# EAGLE design sequencer (EAGLE 9.6.2)
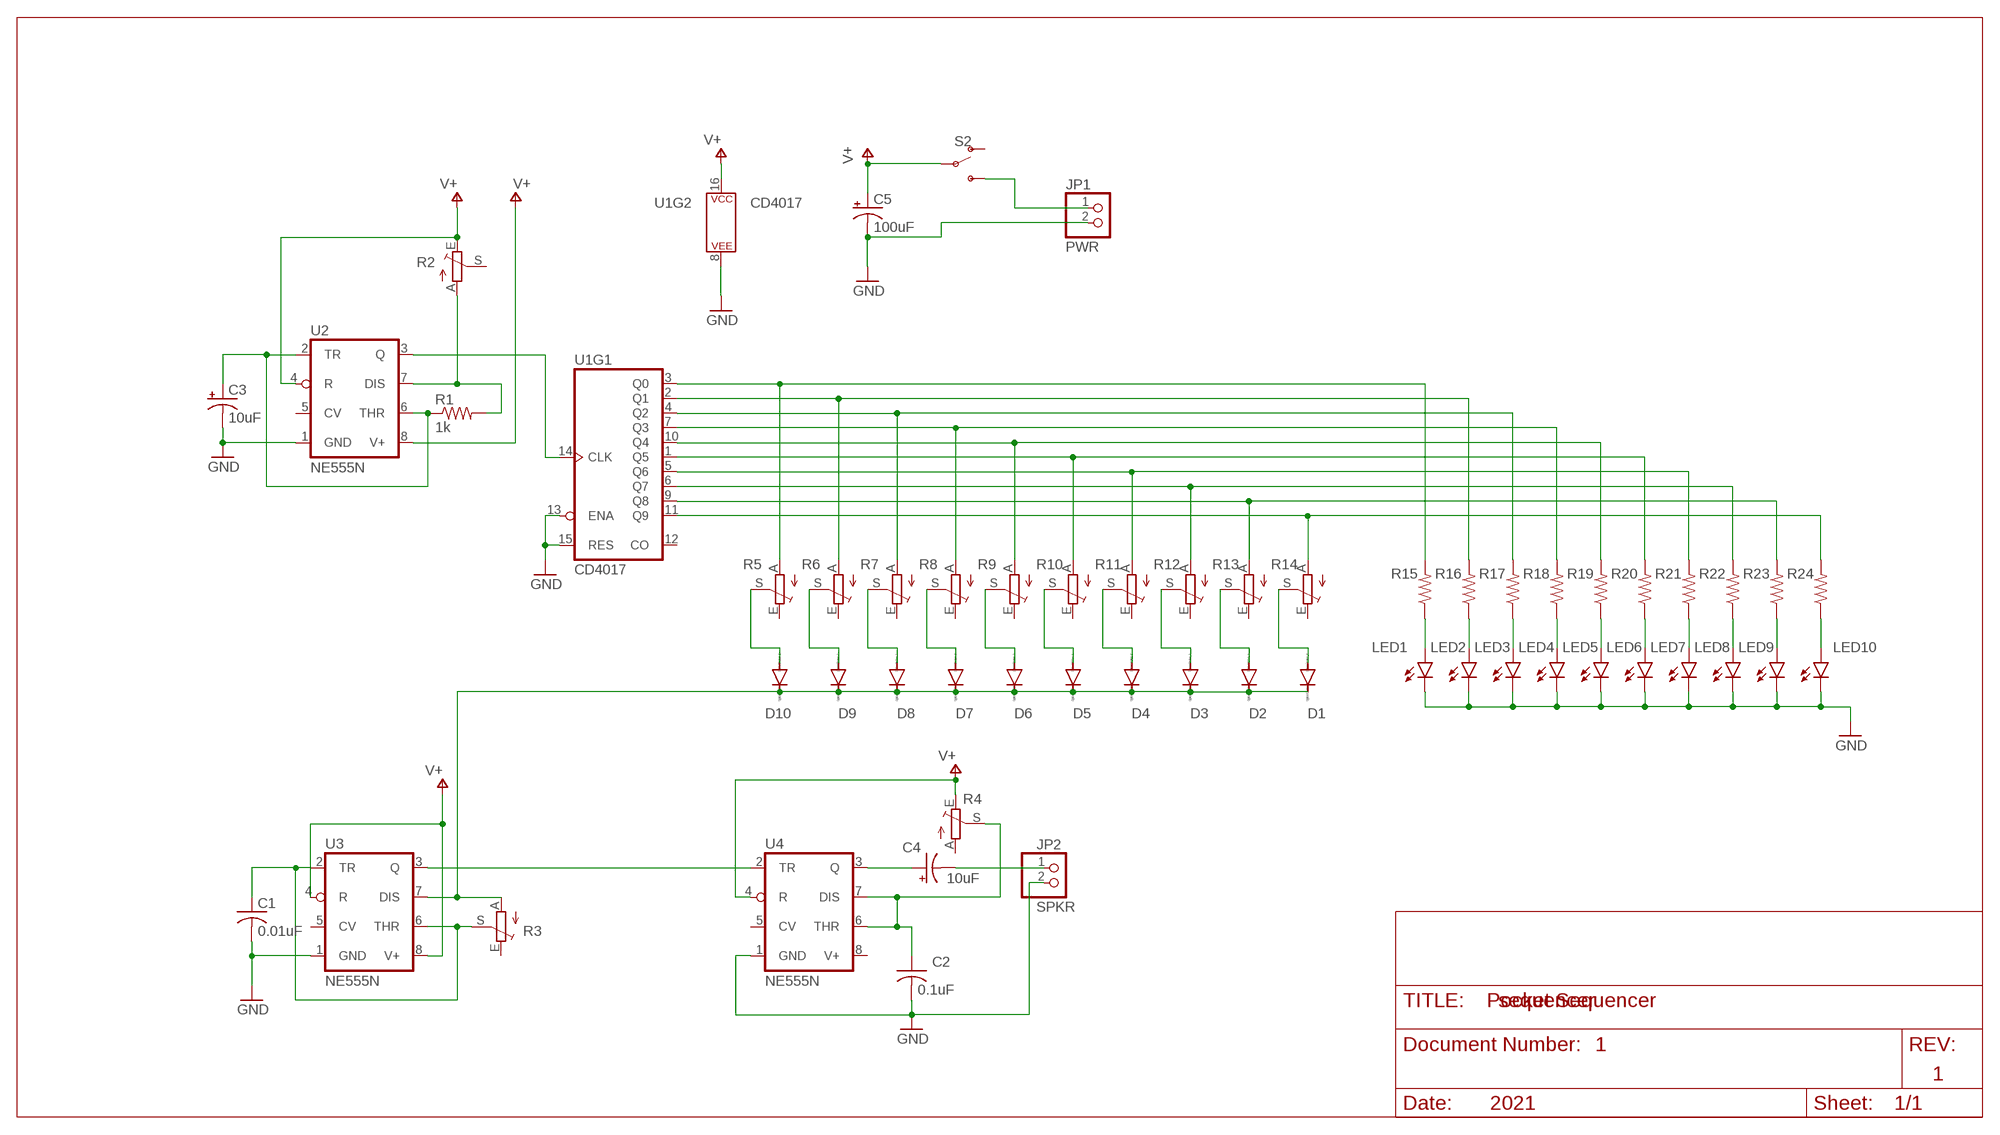
[diagram p0: schematic, sheet 1]

## Parts
C1  0.01uF  C-US025-025X050  [C025-025X050]
C2  0.1uF  C-US025-025X050  [C025-025X050]
C3  10uF  CPOL-USE2.5-6  [E2,5-6]
C4  10uF  CPOL-USE2.5-6  [E2,5-6]
C5  100uF  CPOL-USE2.5-7  [E2,5-7]
D1  1N4148DO35-7  [DO35-7]
D2  1N4148DO35-7  [DO35-7]
D3  1N4148DO35-7  [DO35-7]
D4  1N4148DO35-7  [DO35-7]
D5  1N4148DO35-7  [DO35-7]
D6  1N4148DO35-7  [DO35-7]
D7  1N4148DO35-7  [DO35-7]
D8  1N4148DO35-7  [DO35-7]
D9  1N4148DO35-7  [DO35-7]
D10  1N4148DO35-7  [DO35-7]
JP1  PWR  PINHD-1X2  [1X02]
JP2  SPKR  PINHD-1X2  [1X02]
LED1  LED3MM  [LED3MM]
LED2  LED3MM  [LED3MM]
LED3  LED3MM  [LED3MM]
LED4  LED3MM  [LED3MM]
LED5  LED3MM  [LED3MM]
LED6  LED3MM  [LED3MM]
LED7  LED3MM  [LED3MM]
LED8  LED3MM  [LED3MM]
LED9  LED3MM  [LED3MM]
LED10  LED3MM  [LED3MM]
R1  1k  R-US_0207/7  [0207/7]
R2  TRIM_EU-CT6  [CT6]
R3  TRIM_EU-CT6  [CT6]
R4  TRIM_EU-CT6  [CT6]
R5  TRIM_EU-CT6  [CT6]
R6  TRIM_EU-CT6  [CT6]
R7  TRIM_EU-CT6  [CT6]
R8  TRIM_EU-CT6  [CT6]
R9  TRIM_EU-CT6  [CT6]
R10  TRIM_EU-CT6  [CT6]
R11  TRIM_EU-CT6  [CT6]
R12  TRIM_EU-CT6  [CT6]
R13  TRIM_EU-CT6  [CT6]
R14  TRIM_EU-CT6  [CT6]
R15  R-US_0207/7  [0207/7]
R16  R-US_0207/7  [0207/7]
R17  R-US_0207/7  [0207/7]
R18  R-US_0207/7  [0207/7]
R19  R-US_0207/7  [0207/7]
R20  R-US_0207/7  [0207/7]
R21  R-US_0207/7  [0207/7]
R22  R-US_0207/7  [0207/7]
R23  R-US_0207/7  [0207/7]
R24  R-US_0207/7  [0207/7]
S2  SWITCH-SPDT-PTH-8.6X4.3MM  [SWITCH_SPDT_8.6X4.3MM]
U1  CD4017  [DIP16]
U2  NE555N  [DIL08]
U3  NE555N  [DIL08]
U4  NE555N  [DIL08]

## Nets
GND [power]: C1.2 C2.2 C3.- C5.- JP1.2 JP2.2 LED1.K(C) LED2.K(C) LED3.K(C) LED4.K(C) LED5.K(C) LED6.K(C) LED7.K(C) LED8.K(C) LED9.K(C) LED10.K(C) U1.8(P$V-) U1.13(ENA) U1.15(RES) U2.1(GND) U3.1(GND) U4.1(GND)
N$1: R1.2 R2.A U2.7(DIS)
N$2: C3.+ R1.1 U2.2(TR) U2.6(THR)
N$3: U1.14(CLK) U2.3(Q)
N$4: R5.A R15.2 U1.3(Q0)
N$5: R6.A R16.2 U1.2(Q1)
N$6: R7.A R17.2 U1.4(Q2)
N$7: R8.A R18.2 U1.7(Q3)
N$8: R9.A R19.2 U1.10(Q4)
N$9: R10.A R20.2 U1.1(Q5)
N$10: R11.A R21.2 U1.5(Q6)
N$11: R12.A R22.2 U1.6(Q7)
N$12: R13.A R23.2 U1.9(Q8)
N$13: R14.A R24.2 U1.11(Q9)
N$14: D10.A R5.S
N$15: D9.A R6.S
N$16: D8.A R7.S
N$17: D7.A R8.S
N$18: D6.A R9.S
N$19: D5.A R10.S
N$20: D4.A R11.S
N$21: D3.A R12.S
N$22: D2.A R13.S
N$23: D1.A R14.S
N$24: LED1.A R15.1
N$25: LED2.A R16.1
N$26: LED3.A R17.1
N$27: LED4.A R18.1
N$28: LED5.A R19.1
N$29: LED6.A R20.1
N$30: LED7.A R21.1
N$31: LED8.A R22.1
N$32: LED9.A R23.1
N$33: LED10.A R24.1
N$34: C2.1 R4.S U4.6(THR) U4.7(DIS)
N$35: JP1.1 S2.3(S)
N$36: C1.1 R3.S U3.2(TR) U3.6(THR)
N$37: U3.3(Q) U4.2(TR)
N$38: D1.C D2.C D3.C D4.C D5.C D6.C D7.C D8.C D9.C D10.C R3.A U3.7(DIS)
N$39: C4.+ U4.3(Q)
N$40: C4.- JP2.1
V+ [power]: C5.+ R2.E R4.E S2.2(P) U1.16(P$V+) U2.4(R) U2.8(V+) U3.4(R) U3.8(V+) U4.4(R)
Unconnected: R2.S R3.E R4.A R5.E R6.E R7.E R8.E R9.E R10.E R11.E R12.E R13.E R14.E S2.1(O) U1.12(CO) U2.5(CV) U3.5(CV) U4.5(CV)

## Notes on the sheet
- Pocket Sequencer
- 1
- 1
- 2021

## Power pins joined to a net without a drawn wire
V+: U4.8(V+)

## Library data of the parts
C1 C2 = rcl:C-US: CAPACITOR, American symbol; SPICEPREFIX: C
C3-C5 = rcl:CPOL-US: POLARIZED CAPACITOR, American symbol; SPICEPREFIX: C
D1-D10 = diode:1N4148: DIODE high speed (Philips)
JP1 JP2 = pinhead:PINHD-1X2: PIN HEADER
LED1-LED10 = led:LED: LED OSRAM: - CHIPLED LG R971, LG N971, LY N971, LG Q971, LY Q971, LO R971, LY R971 LH N974, LH R974 LS Q976, LO Q976, LY Q976 LO Q996 - Hyper CHIPLED LW Q18S LB Q993, LB Q99A, LB R99A - SideLED LS A670, LO A670, LY A670, LG A670, LP A670 LB A673, LV A673, LT A673, LW A673 LH A674 LY A675 LS A676, LA A676, LO A676, LY A676, LW A676 LS A679, LY A679, LG A679 - Hyper Micro SIDELED® LS Y876, LA Y876, LO Y876, LY Y876 LT Y87S - SmartLED LW L88C, LW L88S LB L89C, LB L89S, LG L890 LS L89K, LO L89K, LY L89K LS L896, LA L896, LO L896, LY L896 - TOPLED LS T670, LO T670, LY T670, LG T670, LP T670 LSG T670, LSP T670, LSY T670, LOP T670, LYG T670 LG T671, LOG T671, LSG T671 LB T673, LV T673, LT T673, LW T673 LH T674 LS T676, LA T676, LO T676, LY T676, LB T676, LH T676, LSB T676, LW T676 LB T67C, LV T67C, LT T67C, LS T67K, LO T67K, LY T67K, LW E67C LS E67B, LA E67B, LO E67B, LY E67B, LB E67C, LV E67C, LT E67C LW T67C LS T679, LY T679, LG T679 LS T770, LO T770, LY T770, LG T770, LP T770 LB T773, LV T773, LT T773, LW T773 LH T774 LS E675, LA E675, LY E675, LS T675 LS T776, LA T776, LO T776, LY T776, LB T776 LHGB T686 LT T68C, LB T68C - Hyper Mini TOPLED® LB M676 - Mini TOPLED Santana® LG M470 LS M47K, LO M47K, LY M47K Source: http://www.osram.convergy.de LUXEON: - LUMILED® LXK2-PW12-R00, LXK2-PW12-S00, LXK2-PW14-U00, LXK2-PW14-V00 LXK2-PM12-R00, LXK2-PM12-S00, LXK2-PM14-U00 LXK2-PE12-Q00, LXK2-PE12-R00, LXK2-PE12-S00, LXK2-PE14-T00, LXK2-PE14-U00 LXK2-PB12-K00, LXK2-PB12-L00, LXK2-PB12-M00, LXK2-PB14-N00, LXK2-PB14-P00, LXK2-PB14-Q00 LXK2-PR12-L00, LXK2-PR12-M00, LXK2-PR14-Q00, LXK2-PR14-R00 LXK2-PD12-Q00, LXK2-PD12-R00, LXK2-PD12-S00 LXK2-PH12-R00, LXK2-PH12-S00 LXK2-PL12-P00, LXK2-PL12-Q00, LXK2-PL12-R00 Source: www.luxeon.com KINGBRIGHT: KA-3528ASYC Source: www.kingbright.com
R1 R15-R24 = rcl:R-US_: RESISTOR, American symbol; SPICEPREFIX: R
R2-R14 = pot:TRIM_EU-: POTENTIOMETER
S2 = SparkFun-Switches:SWITCH-SPDT: Single Pole, Double Throw (SPDT) Switch Single-pole, double-throw (SPDT) switch. Variant Overview SMD-AYZ0202 Surface Mount DPDT Switch <https://www.sparkfun.com/products/597> (COM-00597) Used on e.g. LilyPad Arduino USB - ATmega32U4 Board <https://www.sparkfun.com/products/12049> PTH-11.6X4.0MM SPDT Mini Power Switch <https://www.sparkfun.com/products/102> (COM-00102) Used on e.g. SparkFun Simon Says - Through-Hole Soldering Kit <https://www.sparkfun.com/products/10547> (KIT-10547) PTH-11.6X4.0MM-KIT KIT version of SPDT Mini Power Switch - Simplifies soldering by removing tStop of switch pins - only one side can be soldered. PTH-11.6X4.0MM-LOCK LOCK version of SPDT Mini Power Switch - Offset pins hold switch in place for easier soldering. SMD-RIGHT-ANGLE Surface Mount Right Angle Switch <https://www.sparkfun.com/products/10860> (COM-10860) Used on e.g. SparkFun ESP8266 Thing <https://www.sparkfun.com/products/13231>; PROD_ID: SWCH-14746
U1 = SparkFun-IC-Logic:CD4017: 10-Out Decade Counter Datasheet <https://cdn.sparkfun.com/datasheets/Kits/cd4022b.pdf> SparkFun Products SparkFun SparkPunk Sequencer Kit <https://www.sparkfun.com/products/12707> (KIT-12707); PROD_ID: IC-11929
U2-U4 = linear:*555: TIMER

## Net classes
0 default: width 0.762 mm
1 power: width 1.27 mm

## Board
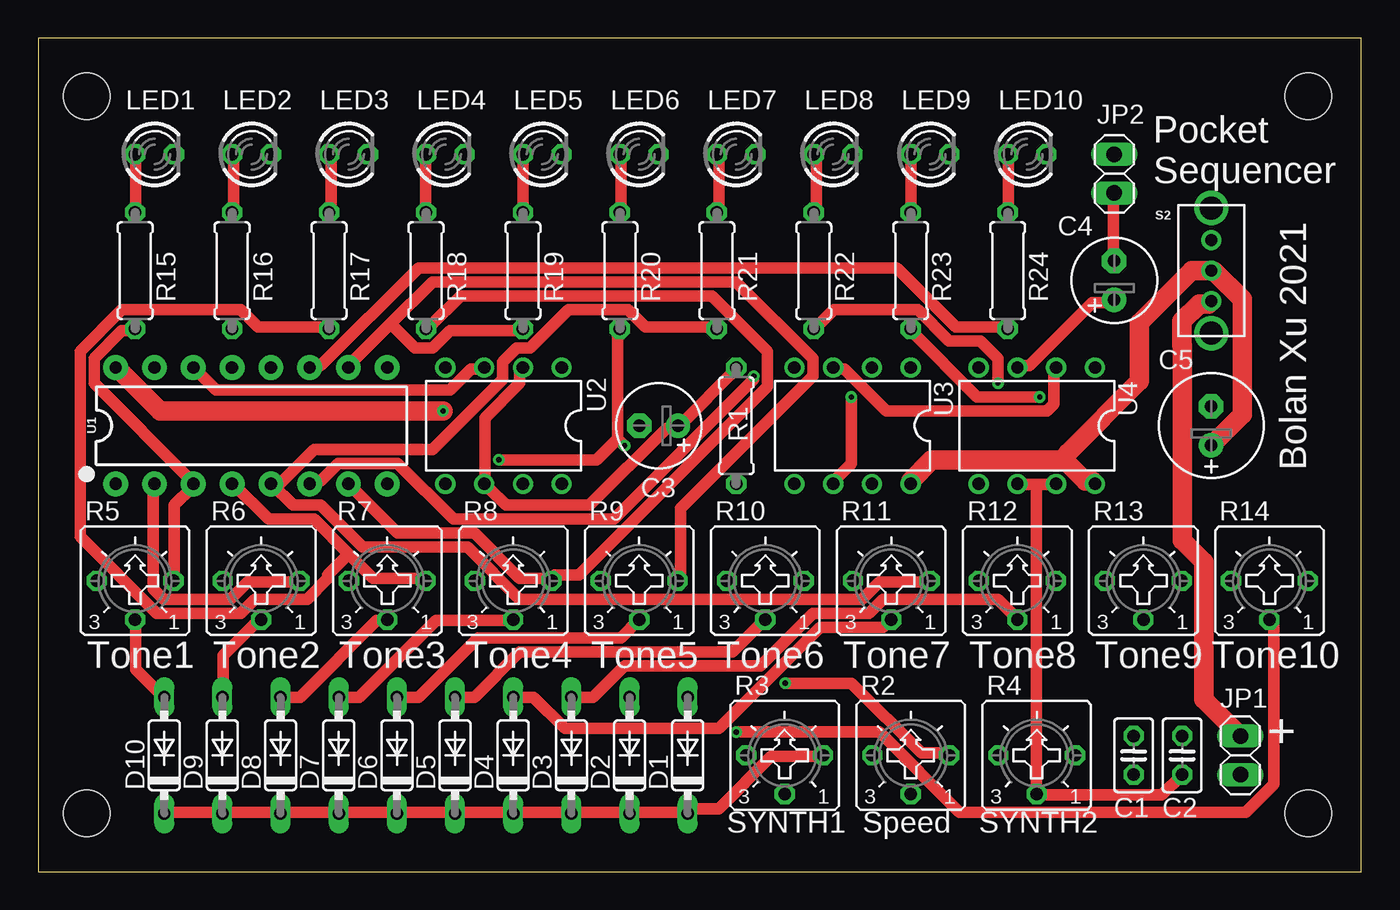
[diagram p1: board, top side]
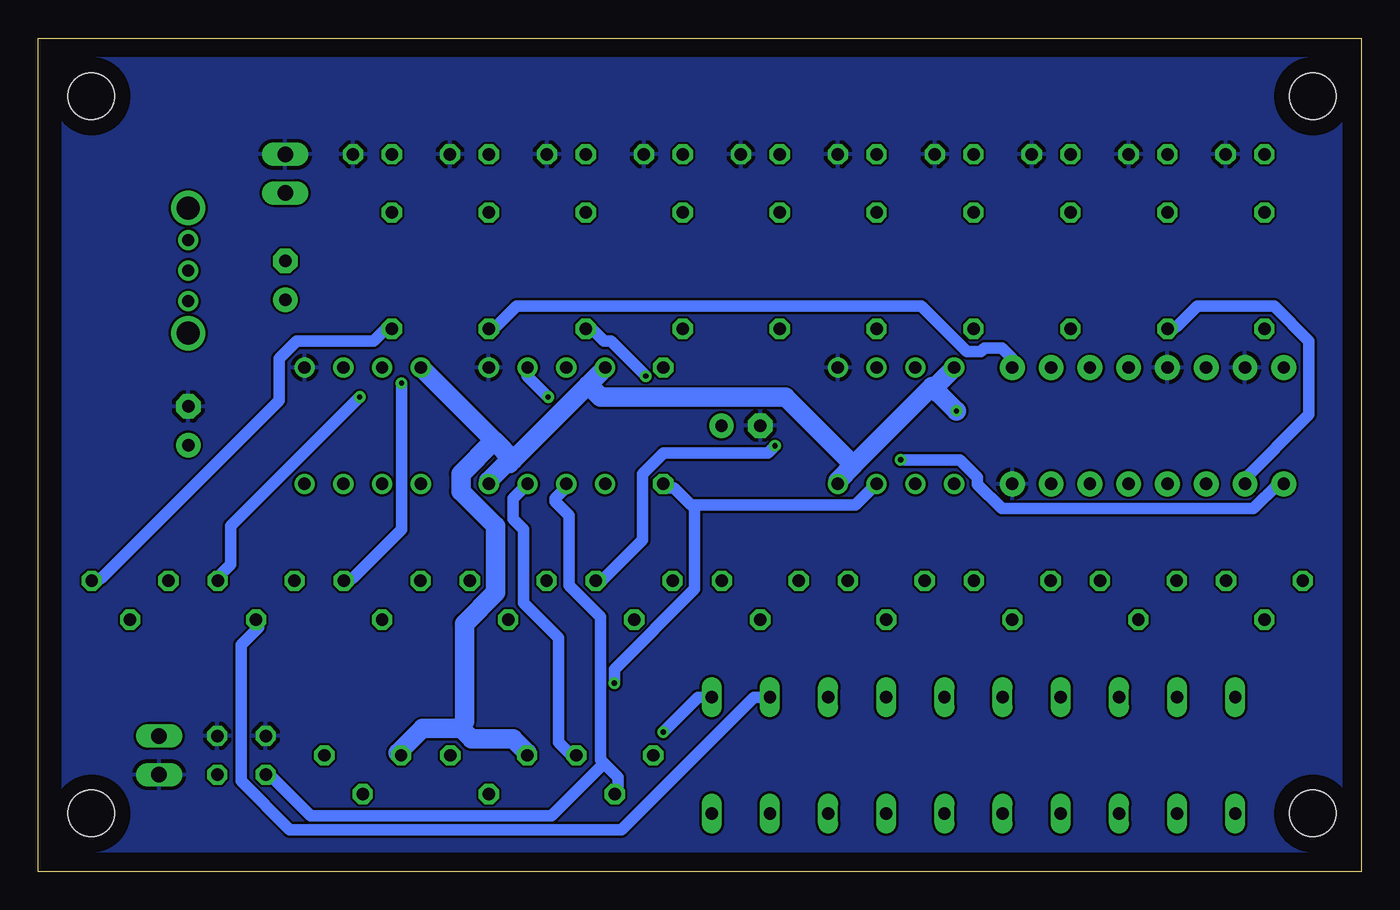
[diagram p2: board, bottom side, seen from below]

Size 86.67 x 54.6 mm. Coordinates in mm from the lower left corner, seen from the top.
Outline: 0,0 86.67,0 86.67,54.6 0,54.6 0,0
Copper layers (1*16): Top 0.035mm / dielectric 1.5mm / Bottom 0.035mm
Design rules "default": minimum track width 6mil, minimum drill 0.35mm, track to track 6mil, track to pad 6mil, pad to pad 6mil, via to via 6mil, smd to smd 6mil, copper to edge 40mil, drill to drill 6mil, minimum pad ring 10mil, minimum via ring 8mil, stop-mask expansion 4mil, vias tented up to drill 0mil, thermal gap 10mil
Holes 3.05 mm at 3.17,50.8 83.19,50.8 83.19,3.81 3.17,3.81

### Footprints (pad centres in the part's own frame; a part is rotated, then mirrored left to right if it is on the bottom)
C025-025X050 = drill 0.813 octagon: 1 -1.27,0; 2 1.27,0
E2,5-6 = drill 0.813 pad 1.6: + -1.27,0 | drill 0.813 pad 1.6 octagon: - 1.27,0
E2,5-7 = drill 0.813 pad 1.6: + -1.27,0 | drill 0.813 pad 1.6 octagon: - 1.27,0
DO35-7 = drill 0.813 long: A 3.81,0; C -3.81,0
1X02 = drill 1.016 long: 1 -1.27,0; 2 1.27,0
LED3MM = drill 0.813 octagon: A -1.27,0; K 1.27,0
0207/7 = drill 0.813 octagon: 1 -3.81,0; 2 3.81,0
CT6 = drill 0.813 octagon: A 2.515,0; E -2.515,0; S 0,-2.54
SWITCH_SPDT_8.6X4.3MM = drill 0.8: 1 -2,0; 2 0,0; 3 2,0 | drill 1.5: 4 -4.1,0; 5 4.1,0
DIP16 = drill 0.813 pad 1.626: 1 -8.89,-3.81; 2 -6.35,-3.81; 3 -3.81,-3.81; 4 -1.27,-3.81; 5 1.27,-3.81; 6 3.81,-3.81; 7 6.35,-3.81; 8 8.89,-3.81; 9 8.89,3.81; 10 6.35,3.81; 11 3.81,3.81; 12 1.27,3.81; 13 -1.27,3.81; 14 -3.81,3.81; 15 -6.35,3.81; 16 -8.89,3.81
DIL08 = drill 0.813 pad 1.27: 1 -3.81,-3.81; 2 -1.27,-3.81; 3 1.27,-3.81; 4 3.81,-3.81; 5 3.81,3.81; 6 1.27,3.81; 7 -1.27,3.81; 8 -3.81,3.81

### Placement (x,y rotation side)
C1  71.75,7.62 90 top
C2  74.93,7.62 90 top
C3  40.64,29.21 180 top
C4  70.48,38.73 90 top
C5  76.83,29.21 90 top
D1  42.55,7.62 90 top
D2  38.73,7.62 90 top
D3  34.92,7.62 90 top
D4  31.11,7.62 90 top
D5  27.3,7.62 90 top
D6  23.5,7.62 90 top
D7  19.68,7.62 90 top
D8  15.88,7.62 90 top
D9  12.06,7.62 90 top
D10  8.26,7.62 90 top
JP1  78.74,7.62 270 top
JP2  70.48,45.72 90 top
LED1  7.62,46.99 0 top
LED2  13.97,46.99 0 top
LED3  20.32,46.99 0 top
LED4  26.67,46.99 0 top
LED5  33.02,46.99 0 top
LED6  39.37,46.99 0 top
LED7  45.72,46.99 0 top
LED8  52.07,46.99 0 top
LED9  58.42,46.99 0 top
LED10  64.77,46.99 0 top
R1  45.72,29.21 270 top
R2  57.15,7.62 0 top
R3  48.9,7.62 0 top
R4  65.41,7.62 0 top
R5  6.35,19.05 0 top
R6  14.61,19.05 0 top
R7  22.86,19.05 0 top
R8  31.11,19.05 0 top
R9  39.37,19.05 0 top
R10  47.62,19.05 0 top
R11  55.88,19.05 0 top
R12  64.14,19.05 0 top
R13  72.39,19.05 0 top
R14  80.64,19.05 0 top
R15  6.35,39.37 270 top
R16  12.7,39.37 270 top
R17  19.05,39.37 270 top
R18  25.4,39.37 270 top
R19  31.75,39.37 270 top
R20  38.1,39.37 270 top
R21  44.45,39.37 270 top
R22  50.8,39.37 270 top
R23  57.15,39.37 270 top
R24  63.5,39.37 270 top
S2  76.83,39.37 270 top
U1  13.97,29.21 0 top
U2  30.48,29.21 180 top
U3  53.34,29.21 180 top
U4  65.41,29.21 180 top

### Tracks (layer width: path | path; a pad name or v marks a point on that pad's centre or on a via)
GND
  pour Bottom: 1.27,53.34 1.27,1.27 85.09,1.27 85.09,53.34
N$1  (via drill 0.35)
  Top 0.762: v48.92,12.34 53.26,12.34 57.84,7.77 59.66,7.77 R2.A
  Bottom 0.762: U2.7 33.15,24 43.66,24 | 43.66,24 43.89,24 45.03,25.15 45.26,25.15 45.72,25.6 R1.2 | v48.92,12.34 48.92,13.26 43.66,18.52 43.66,24
N$2
  Top 0.762: R1.1 45.72,32.92 42.06,29.26 C3.+ 41.6,29.03 41.15,29.03 36.12,24 30.63,24 29.49,25.15 U2.6 29.26,25.6 29.26,29.72 31.55,32 31.55,32.92 U2.2
N$3
  Top 0.762: U2.3 29.03,32.92 28.35,32.92 26.98,31.55 11.66,31.55 10.29,32.92 U1.14
N$4
  Top 0.762: R15.2 6.17,35.43 5.49,35.43 3.66,33.6 3.66,32 10.06,25.6 U1.3 10.06,25.15 8.91,24 8.91,19.2 R5.A
N$5
  Top 0.762: R6.A 16.92,18.97 13.72,18.97 12.57,17.83 8.23,17.83 7.54,18.52 7.54,25.38 U1.2
  Bottom 0.762: R16.2 12.57,35.66 12.12,35.66 10.74,37.03 5.71,37.03 3.43,34.75 3.43,29.95 7.77,25.6 U1.2
N$6
  Top 0.762: 20.34,20.8 18.06,23.09 15.09,23.09 12.8,25.38 U1.4 | 20.34,20.8 21.95,19.2 25.38,19.2 R7.A | 20.34,20.8 18.97,19.43 18.97,19.2 17.6,17.83 14.17,17.83 13.26,16.92 7.77,16.92 2.74,21.95 2.74,34.06 5.49,36.8 13.26,36.8 14.4,35.66 18.97,35.66 R17.2
N$7
  Top 0.762: U1.7 23.55,22.17 28.57,22.17 31.55,19.2 33.6,19.2 R8.A 33.83,19.43 35.43,19.43 47.78,31.77 47.78,34.06 44.12,37.72 27.66,37.72 25.6,35.66 R18.2
N$8
  Top 0.762: 23.09,35.89 20.34,33.15 U1.10 | 23.09,35.89 25.83,38.63 45.72,38.63 50.75,33.6 50.75,32.46 42.06,23.77 42.06,19.2 R9.A | 23.09,35.89 24.69,34.29 25.83,34.29 26.98,35.43 31.55,35.43 R19.2
N$9  (via drill 0.35)
  Top 0.762: 37.95,28.35 v38.41,27.89 | 37.95,28.35 37.95,35.43 R20.2 | v30.18,26.98 36.58,26.98 37.95,28.35
  Bottom 0.762: v38.41,27.89 38.86,27.43 45.72,27.43 47.09,26.06 47.09,21.72 49.84,18.97 50.06,18.97 R10.A | v30.18,26.98 26.29,26.98 25.15,25.83 25.15,25.38 23.55,23.77 7.09,23.77 5.49,25.38 5.26,25.38 U1.1
N$10
  Top 0.762: R11.A 58.29,18.97 55.09,18.97 53.95,17.83 31.55,17.83 28.12,21.26 21.26,21.26 18.52,24 16.69,24 15.32,25.38 U1.5 15.77,25.38 18.06,27.66 25.83,27.66 30.4,32.23 30.4,33.38 31.32,34.29 32.23,34.29 34.75,36.8 38.63,36.8 39.78,35.66 44.35,35.66 R21.2
N$11  (via drill 0.35)
  Top 0.762: v62.87,32 62.87,33.6 61.72,34.75 59.66,34.75 57.61,36.8 52.12,36.8 50.98,35.66 R22.2 | v46.86,32.46 46.86,32.23 37.72,23.09 27.2,23.09 23.55,26.75 19.66,26.75 18.52,25.6 17.83,25.6 U1.6
  Bottom 0.762: v62.87,32 62.87,22.4 66.06,19.2 66.52,19.2 R12.A | v46.86,32.46 49.15,34.75 49.61,34.75 50.52,35.66 50.75,35.66 R22.2
N$12  (via drill 0.35)
  Top 0.762: v65.61,31.09 61.49,31.09 57.15,35.43 R23.2
  Bottom 0.762: v65.61,31.09 74.07,22.63 74.07,20.12 74.98,19.2 R13.A | U1.9 22.86,33.6 23.55,34.29 24.69,34.29 24.92,34.06 25.83,34.06 28.8,37.03 55.32,37.03 56.69,35.66 57.15,35.66 R23.2
N$13
  Top 0.762: R24.2 63.32,35.66 60.12,35.66 56.24,39.55 24.92,39.55 18.52,33.15 17.83,33.15 U1.11
  Bottom 0.762: R14.A 82.98,19.2 82.53,19.2 70.87,30.86 70.87,33.6 69.72,34.75 64.69,34.75 63.78,35.66 63.55,35.66 R24.2
N$14
  Top 0.762: R5.S 6.4,16.46 6.4,13.26 8.23,11.43 D10.A
N$15
  Top 0.762: D9.A 12.12,11.43 12.12,14.17 14.4,16.46 R6.S
N$16
  Top 0.762: D8.A 17.14,11.43 22.17,16.46 22.86,16.46 R7.S
N$17
  Top 0.762: D7.A 21.03,11.43 26.06,16.46 31.09,16.46 R8.S
N$18
  Top 0.762: D6.A 24.92,11.43 28.8,15.32 38.18,15.32 R9.S
N$19
  Top 0.762: D5.A 28.57,11.43 31.55,14.4 45.49,14.4 47.55,16.46 R10.S
N$20
  Top 0.762: D4.A 32.46,11.43 34.52,9.37 44.58,9.37 51.21,16 55.32,16 55.78,16.46 R11.S
N$21
  Top 0.762: D3.A 36.35,11.43 38.41,13.49 47.32,13.49 50.75,16.92 54.41,16.92 55.32,17.83 62.87,17.83 64.01,16.69 R12.S
N$22
  Bottom 0.762: D2.A 39.78,11.43 48.46,2.74 70.18,2.74 73.38,5.94 73.38,14.86 72.24,16 72.47,16.23 72.47,16.46 R13.S
N$23  (via drill 0.35)
  Top 0.762: v45.72,9.14 55.09,9.14 60.35,3.89 79.1,3.89 80.92,5.71 80.92,16.23 R14.S
  Bottom 0.762: D1.A 43.43,11.43 v45.72,9.14
N$24
  Top 0.762: R15.1 6.4,43.2 6.4,46.86 LED1.A
N$25
  Top 0.762: R16.1 12.8,43.2 12.8,46.86 LED2.A
N$26
  Top 0.762: R17.1 19.2,43.2 19.2,46.86 LED3.A
N$27
  Top 0.762: R18.1 25.38,43.2 25.38,46.86 LED4.A
N$28
  Top 0.762: R19.1 31.77,43.2 31.77,46.86 LED5.A
N$29
  Top 0.762: R20.1 38.18,43.2 38.18,46.86 LED6.A
N$30
  Top 0.762: R21.1 44.58,43.2 44.58,46.86 LED7.A
N$31
  Top 0.762: R22.1 50.98,43.2 50.98,46.86 LED8.A
N$32
  Top 0.762: LED9.A R23.1
N$33
  Top 0.762: R24.1 63.55,43.2 63.55,46.86 LED10.A
N$34
  Top 0.762: 65.38,25.38 66.52,25.38 U4.7 | 65.38,25.38 64.24,25.38 U4.6 | C2.1 73.61,5.03 65.61,5.03 R4.S 65.38,5.26 65.38,25.38
N$35
  Top 1.27: S2.3 76.65,37.18 76.04,37.18 74.92,36.06 74.92,34.48 74.93,34.47 74.93,21.71 76.35,20.29 76.35,11.28 JP1.1
N$36  (via drill 0.35)
  Top 0.762: v53.26,31.09 53.26,26.75 52.12,25.6 U3.6
  Bottom 0.762: 49.61,7.09 49.84,7.32 49.84,16.69 51.89,18.75 51.89,23.32 52.81,24.23 52.81,24.46 51.89,25.38 U3.6 | 49.61,7.09 48.69,6.17 48.69,5.26 R3.S | v53.26,31.09 54.63,32.46 54.63,32.92 U3.2 | 49.61,7.09 53.03,3.66 68.81,3.66 71.32,6.17 71.55,6.17 C1.1
N$37
  Top 0.762: U3.3 52.12,32.92 52.81,32.92 55.55,30.18 66.06,30.18 66.52,30.63 66.52,32.92 U4.2
N$38
  Top 0.762: D10.C 8.46,3.89 11.89,3.89 D9.C 12.34,3.89 15.77,3.89 D8.C 16.23,3.89 19.66,3.89 D7.C 19.89,3.89 23.32,3.89 D6.C 23.77,3.89 27.2,3.89 D5.C 27.66,3.89 31.09,3.89 D4.C 31.32,3.89 34.75,3.89 D3.C 35.2,3.89 38.63,3.89 D2.C 39.09,3.89 42.52,3.89 D1.C 42.75,4.12 44.58,4.12 48.01,7.54 51.21,7.54 R3.A
  Bottom 0.762: U3.7 55.55,24.46 55.55,23.09 54.86,22.4 54.86,17.6 52.58,15.32 52.58,8.46 51.66,7.54 51.44,7.54 R3.A
N$39
  Top 0.762: U4.3 64.24,33.15 64.92,33.15 69.04,37.26 70.41,37.26 C4.+
N$40
  Top 0.762: JP2.1 70.41,44.45 70.41,40.01 C4.-
V+  (via drill 0.35)
  Top 1.27: v26.52,30.18 8,30.18 5.26,32.92 U1.16 | C5.+ 77.04,28.12 78.87,29.95 78.87,37.49 77.04,39.32 S2.2 75.56,39.37 72.14,35.94 72.14,32.13 67.44,27.43 67.21,26.98 | 67.21,26.98 68.58,25.6 69.04,25.6 U4.8 | 67.21,26.98 58.52,26.98 57.15,25.6 U3.8
  Bottom 1.27: 33.26,26.63 28.12,31.77 27.89,31.77 | 33.26,26.63 34.29,25.6 U2.8 | 27.89,31.77 26.75,32.92 U2.4 | v26.52,30.18 27.66,31.32 27.89,31.77 | 58.98,9.37 58.29,8.69 55.55,8.69 54.63,7.77 R2.E | 58.98,9.37 61.49,9.37 63.09,7.77 R4.E | 55.55,26.98 55.78,26.75 56.01,26.75 57.15,25.6 U3.8 | 55.55,26.98 50.63,31.89 | 50.63,31.89 49.61,32.92 U3.4 | 55.55,26.98 56.81,28.23 | 56.81,28.23 U4.4 | 56.81,28.23 58.98,26.06 58.98,24.92 56.69,22.63 56.69,18.29 58.75,16.23 58.75,9.83 58.98,9.37 | 33.26,26.63 37.72,31.09 49.84,31.09 50.63,31.89

### Text on the board
tNames: Pocket / Sequencer | Bolan Xu 2021 | Tone1 | Tone2 | Tone3 | Tone4 | Tone5 | Tone6 | Tone7 | Tone8 | Tone9 | Tone10 | + | SYNTH1 | Speed | SYNTH2